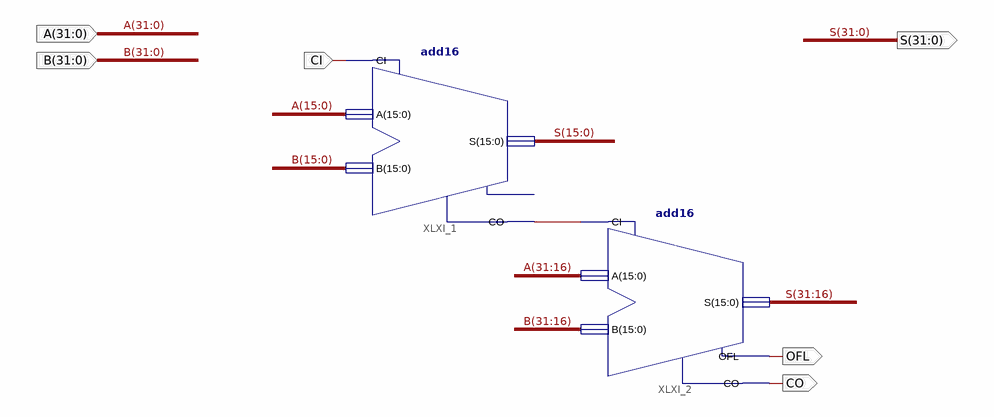
[diagram p0: schematic sheet 1]
// Xilinx ISE schematic adder_32.sch (artix7) as structural Verilog: 2 symbols, 6 ports
module adder_32 (
  input  CI,
  input  [31:0] B,
  input  [31:0] A,
  output CO,
  output OFL,
  output [31:0] S
);

  wire XLXN_1;

  add16 XLXI_1 (.A(A[15:0]), .B(B[15:0]), .CI(CI), .CO(XLXN_1), .S(S[15:0]));  // open: OFL
  add16 XLXI_2 (.A(A[31:16]), .B(B[31:16]), .CI(XLXN_1), .CO(CO), .OFL(OFL), .S(S[31:16]));
endmodule
